# EAGLE design protoboard (EAGLE 6.5.0)
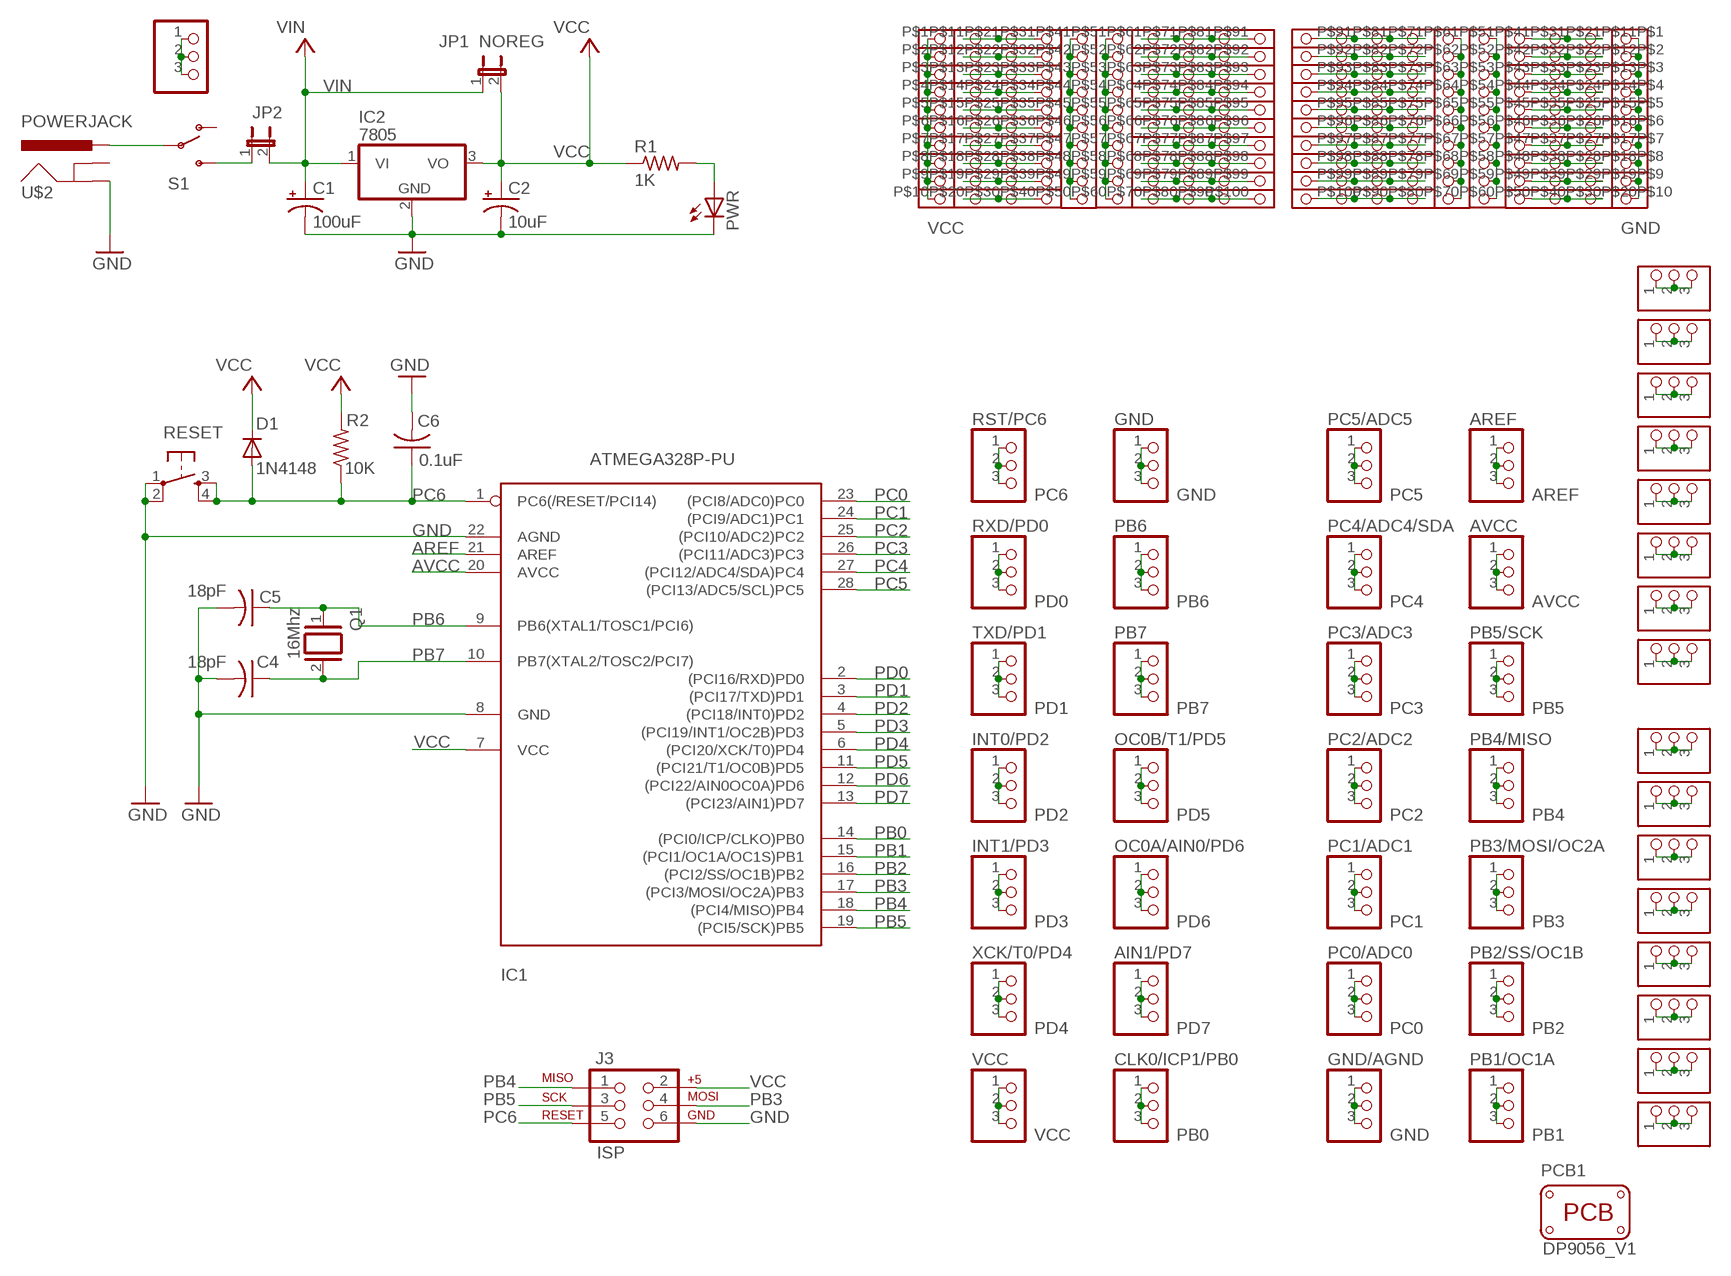
[diagram p0: schematic, sheet 1]

## Parts
AIN1/PD7  PINHD-1X3  [1X03]
AREF  PINHD-1X3  [1X03]
AVCC  PINHD-1X3  [1X03]
C1  100uF  CAP_POLPTH1  [CPOL-RADIAL-100UF-25V]
C2  10uF  CAP_POLPTH2  [CPOL-RADIAL-10UF-25V]
C4  18pF  C-US025-025X050  [C025-025X050]
C5  18pF  C-US025-025X050  [C025-025X050]
C6  0.1uF  C-US025-025X050  [C025-025X050]
CLK0/ICP1/PB0  PINHD-1X3  [1X03]
D1  1N4148  DIODE1N4148  [DIODE-1N4148]
GND  PINHD-1X3  [1X03]
GND/AGND  PINHD-1X3  [1X03]
IC1  ATMEGA328P-PU  ATMEGA168-20P  [DIL28-3]
IC2  7805  7805T  [TO220H]
INT0/PD2  PINHD-1X3  [1X03]
INT1/PD3  PINHD-1X3  [1X03]
J3  ISP  AVR_SPI_PRG_6PTH  [2X3]
JP1  NOREG  JUMPER-2PTH  [1X02]
JP2  TP1  JUMPER-2PTH  [1X02]
OC0A/AIN0/PD6  PINHD-1X3  [1X03]
OC0B/T1/PD5  PINHD-1X3  [1X03]
PB1/OC1A  PINHD-1X3  [1X03]
PB2/SS/OC1B  PINHD-1X3  [1X03]
PB3/MOSI/OC2A  PINHD-1X3  [1X03]
PB4/MISO  PINHD-1X3  [1X03]
PB5/SCK  PINHD-1X3  [1X03]
PB6  PINHD-1X3  [1X03]
PB7  PINHD-1X3  [1X03]
PC0/ADC0  PINHD-1X3  [1X03]
PC1/ADC1  PINHD-1X3  [1X03]
PC2/ADC2  PINHD-1X3  [1X03]
PC3/ADC3  PINHD-1X3  [1X03]
PC4/ADC4/SDA  PINHD-1X3  [1X03]
PC5/ADC5  PINHD-1X3  [1X03]
PCB1  PCB_DP_RECTANGLE-56X90  [DP9056_V1]
PWR  LED3MM  [LED3MM]
Q1  16Mhz  XTAL/S  [QS]
R1  1K  RESISTOR-1/4W  [0207/7]
R2  10K  RESISTOR-1/4W  [0207/7]
RESET  TAC_SWITCHPTH  [TACTILE-PTH]
RST/PC6  PINHD-1X3  [1X03]
RXD/PD0  PINHD-1X3  [1X03]
S1  SWITCH-SPDTPTH  [SWITCH-SPDT]
TXD/PD1  PINHD-1X3  [1X03]
U$1  PROTOFIELD-10X10  [PROTOFIELD-10X10]
U$2  POWERJACK  [POWERJACK_SLOT]
U$3  PROTOFIELD-10X10  [PROTOFIELD-10X10]
U$4  PROTOFIELD-3  [PROTOFIELD-3]
U$5  PROTOFIELD-3  [PROTOFIELD-3]
U$6  PROTOFIELD-3  [PROTOFIELD-3]
U$7  PROTOFIELD-3  [PROTOFIELD-3]
U$8  PROTOFIELD-3  [PROTOFIELD-3]
U$9  PROTOFIELD-3  [PROTOFIELD-3]
U$10  PROTOFIELD-3  [PROTOFIELD-3]
U$11  PROTOFIELD-3  [PROTOFIELD-3]
U$12  PROTOFIELD-3  [PROTOFIELD-3]
U$13  PROTOFIELD-3  [PROTOFIELD-3]
U$14  PROTOFIELD-3  [PROTOFIELD-3]
U$15  PROTOFIELD-3  [PROTOFIELD-3]
U$16  PROTOFIELD-3  [PROTOFIELD-3]
U$17  PROTOFIELD-3  [PROTOFIELD-3]
U$18  PROTOFIELD-3  [PROTOFIELD-3]
U$19  PROTOFIELD-3  [PROTOFIELD-3]
VCC  PINHD-1X3  [1X03]
VIN_  PINHD-1X3  [1X03]
XCK/T0/PD4  PINHD-1X3  [1X03]

## Nets
AREF: AREF.1 AREF.2 AREF.3 IC1.21(AREF)
AVCC: AVCC.1 AVCC.2 AVCC.3 IC1.20(AVCC)
GND: C1.2(-) C2.2(-) C4.2 C5.2 C6.2 GND.1 GND.2 GND.3 GND/AGND.1 GND/AGND.2 GND/AGND.3 IC1.8(GND) IC1.22(AGND) IC2.2(GND) J3.6 PWR.K(C) RESET.1 RESET.2 U$2.GND@1(GND) U$3.P$1 U$3.P$2 U$3.P$3 U$3.P$4 U$3.P$5 U$3.P$6 U$3.P$7 U$3.P$8 U$3.P$9 U$3.P$10
N$1 [supply]: S1.2(P) U$2.PWR
N$2: PWR.A R1.2
N$3 [supply]: JP2.1 S1.3(S)
N$4: U$4.1 U$4.2 U$4.3
N$5: U$5.1 U$5.2 U$5.3
N$6: U$6.1 U$6.2 U$6.3
N$7: U$7.1 U$7.2 U$7.3
N$8: U$8.1 U$8.2 U$8.3
N$9: U$9.1 U$9.2 U$9.3
N$10: U$10.1 U$10.2 U$10.3
N$11: U$11.1 U$11.2 U$11.3
N$12: U$12.1 U$12.2 U$12.3
N$13: U$13.1 U$13.2 U$13.3
N$14: U$14.1 U$14.2 U$14.3
N$15: U$15.1 U$15.2 U$15.3
N$16: U$16.1 U$16.2 U$16.3
N$17: U$17.1 U$17.2 U$17.3
N$18: U$18.1 U$18.2 U$18.3
N$19: U$19.1 U$19.2 U$19.3
N$20: U$1.P$41 U$1.P$42 U$1.P$43 U$1.P$44 U$1.P$45 U$1.P$46 U$1.P$47 U$1.P$48 U$1.P$49 U$1.P$50
N$21: U$1.P$51 U$1.P$52 U$1.P$53 U$1.P$54 U$1.P$55 U$1.P$56 U$1.P$57 U$1.P$58 U$1.P$59 U$1.P$60
N$22: U$1.P$61 U$1.P$71 U$1.P$81 U$1.P$91
N$23: U$1.P$62 U$1.P$72 U$1.P$82 U$1.P$92
N$24: U$1.P$63 U$1.P$73 U$1.P$83 U$1.P$93
N$25: U$1.P$64 U$1.P$74 U$1.P$84 U$1.P$94
N$26: U$1.P$65 U$1.P$75 U$1.P$85 U$1.P$95
N$27: U$1.P$66 U$1.P$76 U$1.P$86 U$1.P$96
N$28: U$1.P$67 U$1.P$77 U$1.P$87 U$1.P$97
N$29: U$1.P$68 U$1.P$78 U$1.P$88 U$1.P$98
N$30: U$1.P$69 U$1.P$79 U$1.P$89 U$1.P$99
N$31: U$1.P$70 U$1.P$80 U$1.P$90 U$1.P$100
N$32: U$1.P$11 U$1.P$21 U$1.P$31
N$33: U$1.P$12 U$1.P$22 U$1.P$32
N$34: U$1.P$13 U$1.P$23 U$1.P$33
N$35: U$1.P$14 U$1.P$24 U$1.P$34
N$36: U$1.P$15 U$1.P$25 U$1.P$35
N$37: U$1.P$16 U$1.P$26 U$1.P$36
N$38: U$1.P$17 U$1.P$27 U$1.P$37
N$39: U$1.P$18 U$1.P$28 U$1.P$38
N$40: U$1.P$19 U$1.P$29 U$1.P$39
N$41: U$1.P$20 U$1.P$30 U$1.P$40
N$42: U$3.P$61 U$3.P$71 U$3.P$81 U$3.P$91
N$43: U$3.P$62 U$3.P$72 U$3.P$82 U$3.P$92
N$44: U$3.P$63 U$3.P$73 U$3.P$83 U$3.P$93
N$45: U$3.P$64 U$3.P$74 U$3.P$84 U$3.P$94
N$46: U$3.P$65 U$3.P$75 U$3.P$85 U$3.P$95
N$47: U$3.P$66 U$3.P$76 U$3.P$86 U$3.P$96
N$48: U$3.P$67 U$3.P$77 U$3.P$87 U$3.P$97
N$49: U$3.P$68 U$3.P$78 U$3.P$88 U$3.P$98
N$50: U$3.P$69 U$3.P$79 U$3.P$89 U$3.P$99
N$51: U$3.P$70 U$3.P$80 U$3.P$90 U$3.P$100
N$52: U$3.P$51 U$3.P$52 U$3.P$53 U$3.P$54 U$3.P$55 U$3.P$56 U$3.P$57 U$3.P$58 U$3.P$59 U$3.P$60
N$53: U$3.P$41 U$3.P$42 U$3.P$43 U$3.P$44 U$3.P$45 U$3.P$46 U$3.P$47 U$3.P$48 U$3.P$49 U$3.P$50
N$54: U$3.P$11 U$3.P$21 U$3.P$31
N$55: U$3.P$12 U$3.P$22 U$3.P$32
N$56: U$3.P$13 U$3.P$23 U$3.P$33
N$57: U$3.P$14 U$3.P$24 U$3.P$34
N$58: U$3.P$15 U$3.P$25 U$3.P$35
N$59: U$3.P$16 U$3.P$26 U$3.P$36
N$60: U$3.P$17 U$3.P$27 U$3.P$37
N$61: U$3.P$18 U$3.P$28 U$3.P$38
N$62: U$3.P$19 U$3.P$29 U$3.P$39
N$63: U$3.P$20 U$3.P$30 U$3.P$40
PB0: CLK0/ICP1/PB0.1 CLK0/ICP1/PB0.2 CLK0/ICP1/PB0.3 IC1.14((PCI0/ICP/CLKO)PB0)
PB1: IC1.15((PCI1/OC1A/OC1S)PB1) PB1/OC1A.1 PB1/OC1A.2 PB1/OC1A.3
PB2: IC1.16((PCI2/SS/OC1B)PB2) PB2/SS/OC1B.1 PB2/SS/OC1B.2 PB2/SS/OC1B.3
PB3: IC1.17((PCI3/MOSI/OC2A)PB3) J3.4 PB3/MOSI/OC2A.1 PB3/MOSI/OC2A.2 PB3/MOSI/OC2A.3
PB4: IC1.18((PCI4/MISO)PB4) J3.1 PB4/MISO.1 PB4/MISO.2 PB4/MISO.3
PB5: IC1.19((PCI5/SCK)PB5) J3.3 PB5/SCK.1 PB5/SCK.2 PB5/SCK.3
PB6: C5.1 IC1.9(PB6(XTAL1/TOSC1/PCI6)) PB6.1 PB6.2 PB6.3 Q1.1
PB7: C4.1 IC1.10(PB7(XTAL2/TOSC2/PCI7)) PB7.1 PB7.2 PB7.3 Q1.2
PC0: IC1.23((PCI8/ADC0)PC0) PC0/ADC0.1 PC0/ADC0.2 PC0/ADC0.3
PC1: IC1.24((PCI9/ADC1)PC1) PC1/ADC1.1 PC1/ADC1.2 PC1/ADC1.3
PC2: IC1.25((PCI10/ADC2)PC2) PC2/ADC2.1 PC2/ADC2.2 PC2/ADC2.3
PC3: IC1.26((PCI11/ADC3)PC3) PC3/ADC3.1 PC3/ADC3.2 PC3/ADC3.3
PC4: IC1.27((PCI12/ADC4/SDA)PC4) PC4/ADC4/SDA.1 PC4/ADC4/SDA.2 PC4/ADC4/SDA.3
PC5: IC1.28((PCI13/ADC5/SCL)PC5) PC5/ADC5.1 PC5/ADC5.2 PC5/ADC5.3
PC6: C6.1 D1.A IC1.1(PC6(/RESET/PCI14)) J3.5 R2.1 RESET.3 RESET.4 RST/PC6.1 RST/PC6.2 RST/PC6.3
PD0: IC1.2((PCI16/RXD)PD0) RXD/PD0.1 RXD/PD0.2 RXD/PD0.3
PD1: IC1.3((PCI17/TXD)PD1) TXD/PD1.1 TXD/PD1.2 TXD/PD1.3
PD2: IC1.4((PCI18/INT0)PD2) INT0/PD2.1 INT0/PD2.2 INT0/PD2.3
PD3: IC1.5((PCI19/INT1/OC2B)PD3) INT1/PD3.1 INT1/PD3.2 INT1/PD3.3
PD4: IC1.6((PCI20/XCK/T0)PD4) XCK/T0/PD4.1 XCK/T0/PD4.2 XCK/T0/PD4.3
PD5: IC1.11((PCI21/T1/OC0B)PD5) OC0B/T1/PD5.1 OC0B/T1/PD5.2 OC0B/T1/PD5.3
PD6: IC1.12((PCI22/AIN0OC0A)PD6) OC0A/AIN0/PD6.1 OC0A/AIN0/PD6.2 OC0A/AIN0/PD6.3
PD7: AIN1/PD7.1 AIN1/PD7.2 AIN1/PD7.3 IC1.13((PCI23/AIN1)PD7)
VCC: C2.1(+) D1.C IC1.7(VCC) IC2.3(VO) J3.2 JP1.2 R1.1 R2.2 U$1.P$1 U$1.P$2 U$1.P$3 U$1.P$4 U$1.P$5 U$1.P$6 U$1.P$7 U$1.P$8 U$1.P$9 U$1.P$10 VCC.1 VCC.2 VCC.3
VIN [supply]: C1.1(+) IC2.1(VI) JP1.1 JP2.2 VIN_.1 VIN_.2 VIN_.3
Unconnected: S1.1(O) U$2.GND@2(GNDBREAK)

## Library data of the parts
AIN1/PD7 AREF AVCC CLK0/ICP1/PB0 GND GND/AGND INT0/PD2 INT1/PD3 OC0A/AIN0/PD6 OC0B/T1/PD5 PB1/OC1A PB2/SS/OC1B PB3/MOSI/OC2A PB4/MISO PB5/SCK PB6 PB7 PC0/ADC0 PC1/ADC1 PC2/ADC2 PC3/ADC3 PC4/ADC4/SDA PC5/ADC5 RST/PC6 RXD/PD0 TXD/PD1 VCC VIN_ XCK/T0/PD4 = ubiyubix:PINHD-1X3
C1 C2 = SparkFun-Passives:CAP_POL: Capacitor Polarized These are standard SMD and PTH capacitors. Normally 10uF, 47uF, and 100uF in electrolytic and tantalum varieties. Always verify the external diameter of the through hole cap, it varies with capacity, voltage, and manufacturer. The EIA devices should be standard.
C4-C6 = rcl:C-US: CAPACITOR, American symbol
D1 = SparkFun-DiscreteSemi:DIODE: Diode These are standard reverse protection diodes and small signal diodes. SMA package can handle up to about 1A. SOD-323 can handle about 200mA. What the SOD-323 package when ordering, there are some mfgs out there that are 5-pin packages.
IC1 = adafruit:ATMEGA168*P: MICROCONTROLLER 16 kBytes FLASH 1 kBytes SRAM 512 Bytes EEPROM USART 8-channel 10 bit ADC
IC2 = linear:78*: Positive VOLTAGE REGULATOR Source: http://cache.national.com/ds/LM/LM78L05.pdf http://www.fairchildsemi.com/ds/LM/LM7805.pdf
J3 = SparkFun-Connectors:AVR_SPI_PRG_6: AVR ISP 6 Pin This is the reduced ISP connector for AVR programming. Common on Arduino. This footprint will take up less PCB space and can be used with a 10-pin to 6-pin adapter such as SKU: BOB-08508
JP1 JP2 = SparkFun-Passives:JUMPER-2: Jumper Basic 0.1" spaced jumper. Use with breakaway headers.
PCB1 = dp_devices:PCB_DP_RECTANGLE: Dangerous Prototypes Standard Rectangular PCB sizes; PCB_SIZE: DP9056_V1
PWR = SparkFun-LED:LED: LEDs Standard schematic elements and footprints for 5mm, 3mm, 1206, and 0603 sized LEDs. 5mm - Spark Fun Electronics SKU : COM-00529 (and others)
Q1 = SmartPrj:XTAL/S: CRYSTAL
R1 R2 = ubiyubix:RESISTOR-1/4W
RESET = SparkFun-Electromechanical:TAC_SWITCH: Momentary Switch Button commonly used for reset or general input. Spark Fun Electronics SKU : COM-00097
S1 = ubiyubix:SWITCH-SPDT: SPST Switch Simple slide switch. Spark Fun Electronics SKU : COM-00102
U$1 U$3 = ubiyubix:PROTOFIELD-10X10
U$2 = ubiyubix:POWERJACK
U$4-U$19 = ubiyubix:PROTOFIELD-3

## Net classes
0 default: width 0.406 mm
1 supply: width 0.508 mm

## Board
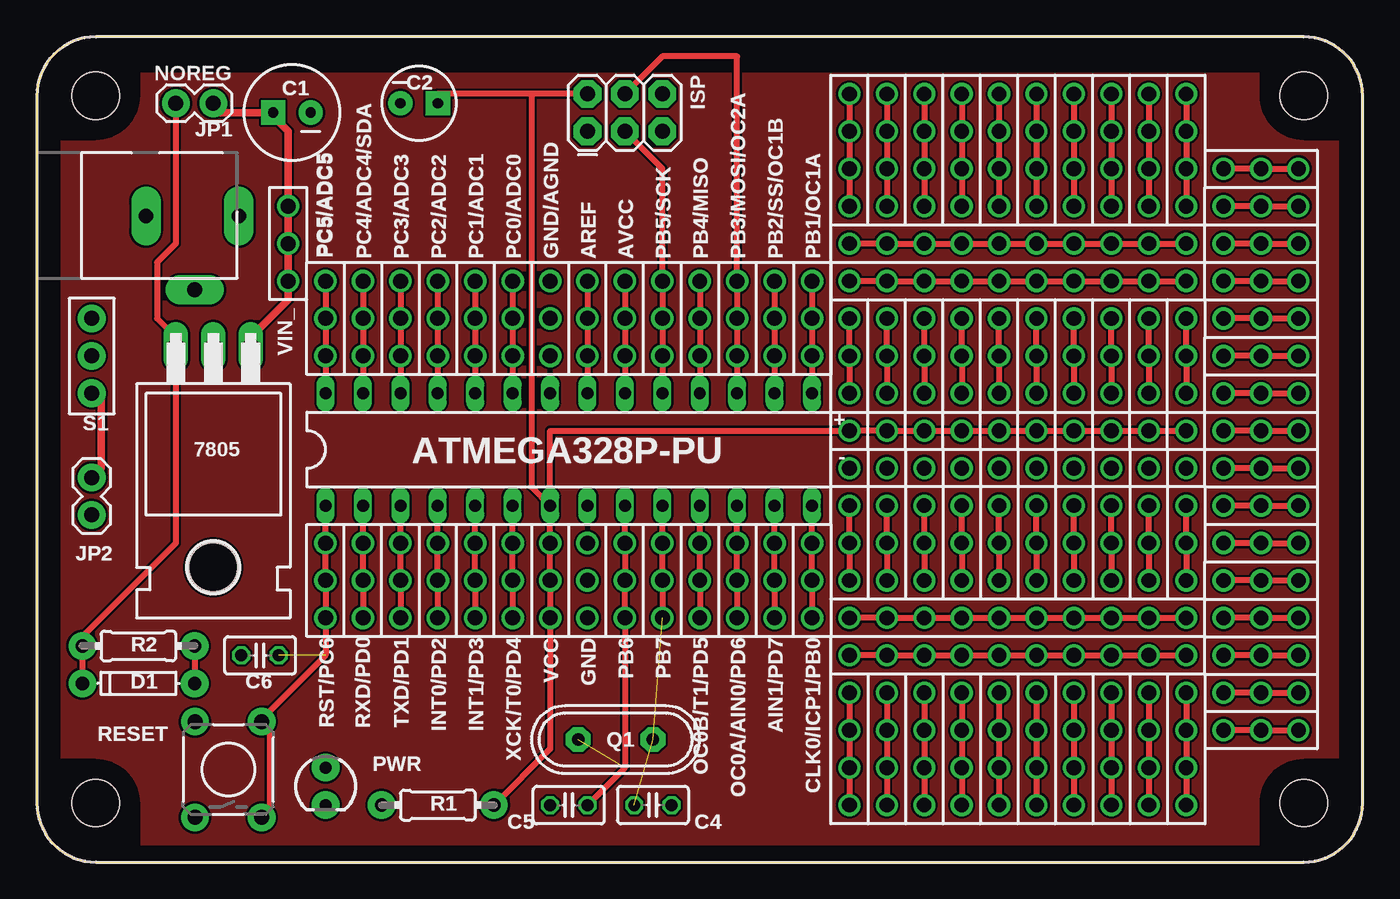
[diagram p1: board, top side]
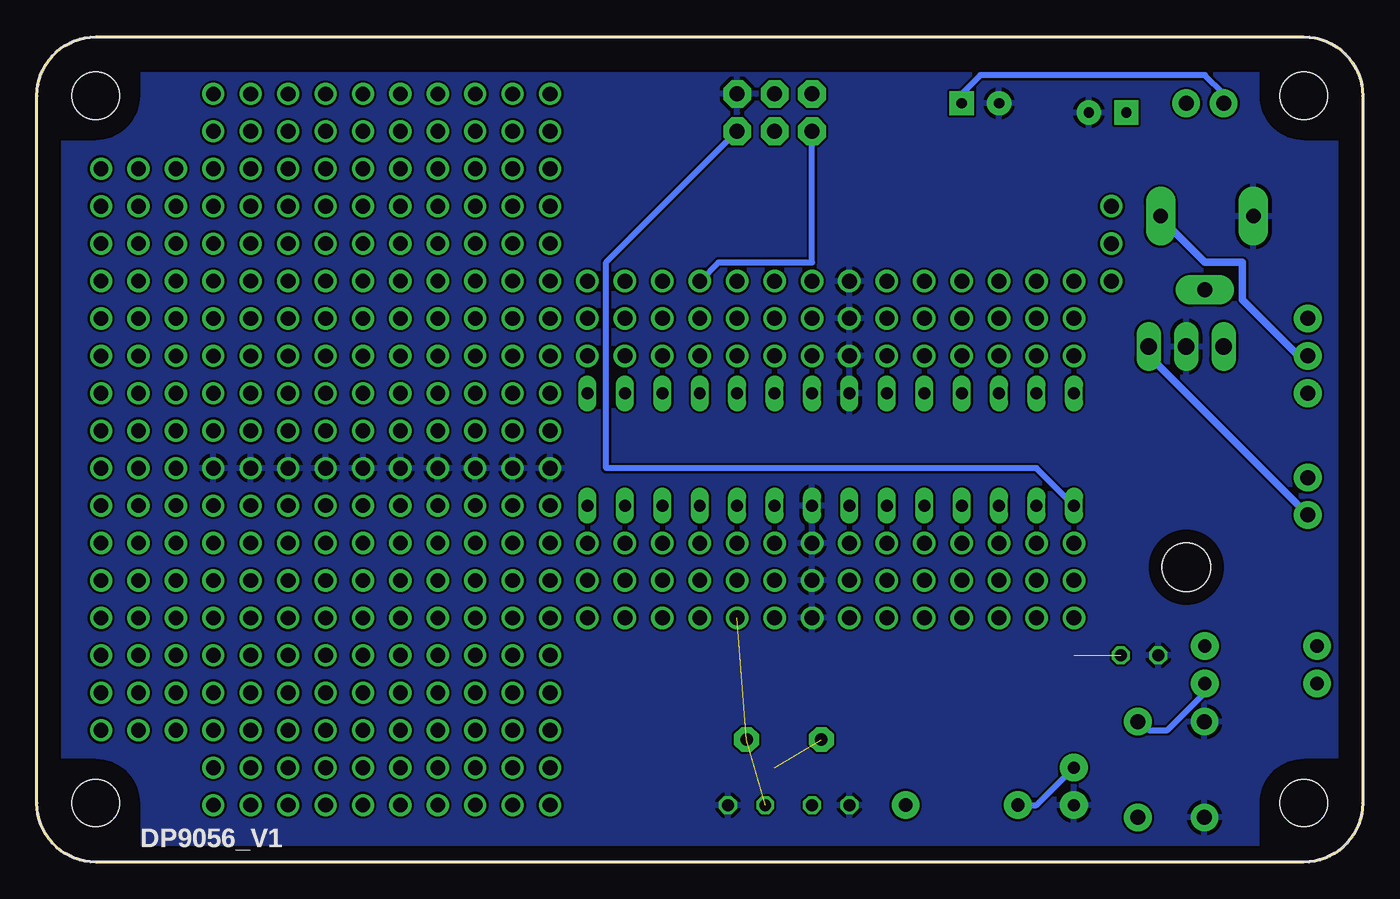
[diagram p2: board, bottom side, seen from below]

Size 90 x 56 mm. Coordinates in mm from the lower left corner, seen from the top.
Copper layers (1*16): Top 0.0356mm / dielectric 1.5011mm / Bottom 0.0356mm
Design rules "LaenPCBOrder (1)": minimum track width 6mil, minimum drill 13mil, track to track 6mil, track to pad 6mil, pad to pad 6mil, via to via 6mil, smd to smd 6mil, copper to edge 15mil, drill to drill 6mil, minimum pad ring 7mil, minimum via ring 7mil, stop-mask expansion 3mil, vias tented up to drill 0mil, thermal gap 10mil

### Footprints (pad centres in the part's own frame; a part is rotated, then mirrored left to right if it is on the bottom)
1X03 = drill 1.016: 1 -2.54,0; 2 0,0; 3 2.54,0
CPOL-RADIAL-100UF-25V = drill 0.7 pad 1.651 square: 1 1.27,0 | drill 0.7 pad 1.651: 2 -1.27,0
CPOL-RADIAL-10UF-25V = drill 0.7 pad 1.651 square: 1 1.27,0 | drill 0.7 pad 1.651: 2 -1.27,0
C025-025X050 = drill 0.813 octagon: 1 -1.27,0; 2 1.27,0
DIODE-1N4148 = drill 0.9 pad 1.88: A -3.81,0; C 3.81,0
DIL28-3 = drill 0.813 long: 1 -16.51,-3.81; 2 -13.97,-3.81; 3 -11.43,-3.81; 4 -8.89,-3.81; 5 -6.35,-3.81; 6 -3.81,-3.81; 7 -1.27,-3.81; 8 1.27,-3.81; 9 3.81,-3.81; 10 6.35,-3.81; 11 8.89,-3.81; 12 11.43,-3.81; 13 13.97,-3.81; 14 16.51,-3.81; 15 16.51,3.81; 16 13.97,3.81; 17 11.43,3.81; 18 8.89,3.81; 19 6.35,3.81; 20 3.81,3.81; 21 1.27,3.81; 22 -1.27,3.81; 23 -3.81,3.81; 24 -6.35,3.81; 25 -8.89,3.81; 26 -11.43,3.81; 27 -13.97,3.81; 28 -16.51,3.81
TO220H = drill 1.118 long: 1 -2.54,-10.16; 2 0,-10.16; 3 2.54,-10.16 | hole 3.302: 0,4.826
2X3 = drill 1.016 pad 1.88 octagon: 1 0,0; 2 0,2.54; 3 2.54,0; 4 2.54,2.54; 5 5.08,0; 6 5.08,2.54
1X02 = drill 1.016 pad 1.88: 1 0,0; 2 2.54,0
DP9056_V1 = hole 3.2: -41,-24; 41,-24; 41,24; -41,24
LED3MM = drill 0.813 pad 1.88: A -1.27,0; K 1.27,0
QS = drill 0.85 pad 1.676 octagon: 1 -2.54,0; 2 2.54,0
0207/7 = drill 0.9 pad 1.88: 1 -3.81,0; 2 3.81,0
TACTILE-PTH = drill 1.016 pad 1.88: 1 -3.251,2.261; 2 3.251,2.261; 3 -3.251,-2.261; 4 3.251,-2.261
SWITCH-SPDT = drill 1.016 pad 1.88: 1 0,2.54; 2 0,0; 3 0,-2.54
PROTOFIELD-10X10 = drill 1: P$1 -11.43,11.43; P$2 -11.43,8.89; P$3 -11.43,6.35; P$4 -11.43,3.81; P$5 -11.43,1.27; P$6 -11.43,-1.27; P$7 -11.43,-3.81; P$8 -11.43,-6.35; P$9 -11.43,-8.89; P$10 -11.43,-11.43; P$11 -8.89,11.43; P$12 -8.89,8.89; P$13 -8.89,6.35; P$14 -8.89,3.81; P$15 -8.89,1.27; P$16 -8.89,-1.27; P$17 -8.89,-3.81; P$18 -8.89,-6.35; P$19 -8.89,-8.89; P$20 -8.89,-11.43; P$21 -6.35,11.43; P$22 -6.35,8.89; P$23 -6.35,6.35; P$24 -6.35,3.81; P$25 -6.35,1.27; P$26 -6.35,-1.27; P$27 -6.35,-3.81; P$28 -6.35,-6.35; P$29 -6.35,-8.89; P$30 -6.35,-11.43; P$31 -3.81,11.43; P$32 -3.81,8.89; P$33 -3.81,6.35; P$34 -3.81,3.81; P$35 -3.81,1.27; P$36 -3.81,-1.27; P$37 -3.81,-3.81; P$38 -3.81,-6.35; P$39 -3.81,-8.89; P$40 -3.81,-11.43; P$41 -1.27,11.43; P$42 -1.27,8.89; P$43 -1.27,6.35; P$44 -1.27,3.81; P$45 -1.27,1.27; P$46 -1.27,-1.27; P$47 -1.27,-3.81; P$48 -1.27,-6.35; P$49 -1.27,-8.89; P$50 -1.27,-11.43; P$51 1.27,11.43; P$52 1.27,8.89; P$53 1.27,6.35; P$54 1.27,3.81; P$55 1.27,1.27; P$56 1.27,-1.27; P$57 1.27,-3.81; P$58 1.27,-6.35; P$59 1.27,-8.89; P$60 1.27,-11.43; P$61 3.81,11.43; P$62 3.81,8.89; P$63 3.81,6.35; P$64 3.81,3.81; P$65 3.81,1.27; P$66 3.81,-1.27; P$67 3.81,-3.81; P$68 3.81,-6.35; P$69 3.81,-8.89; P$70 3.81,-11.43; P$71 6.35,11.43; P$72 6.35,8.89; P$73 6.35,6.35; P$74 6.35,3.81; P$75 6.35,1.27; P$76 6.35,-1.27; P$77 6.35,-3.81; P$78 6.35,-6.35; P$79 6.35,-8.89; P$80 6.35,-11.43; P$81 8.89,11.43; P$82 8.89,8.89; P$83 8.89,6.35; P$84 8.89,3.81; P$85 8.89,1.27; P$86 8.89,-1.27; P$87 8.89,-3.81; P$88 8.89,-6.35; P$89 8.89,-8.89; P$90 8.89,-11.43; P$91 11.43,11.43; P$92 11.43,8.89; P$93 11.43,6.35; P$94 11.43,3.81; P$95 11.43,1.27; P$96 11.43,-1.27; P$97 11.43,-3.81; P$98 11.43,-6.35; P$99 11.43,-8.89; P$100 11.43,-11.43
POWERJACK_SLOT = drill 1 pad 2 long: GND@1 0.04,-0.12; GND@2 5.04,3.18; PWR 0.04,6.18
PROTOFIELD-3 = drill 1: 1 0,2.54; 2 0,0; 3 0,-2.54

### Placement (x,y rotation side)
AIN1/PD7  50.08,19.11 90 top
AREF  37.38,36.89 90 top
AVCC  39.92,36.89 90 top
C1  17.31,50.86 180 top
C2  25.95,51.5 0 top
C4  41.83,3.87 0 top
C5  36.11,3.87 180 top
C6  15.16,14.03 180 top
CLK0/ICP1/PB0  52.62,19.11 90 top
D1  6.9,12.12 180 top
GND  37.38,19.11 90 top
GND/AGND  34.84,36.89 90 top
IC1  36.11,28 0 top
IC2  11.98,24.82 180 top
INT0/PD2  27.22,19.11 90 top
INT1/PD3  29.76,19.11 90 top
J3  37.38,49.59 0 top
JP1  11.98,51.5 180 top
JP2  3.73,26.09 270 top
OC0A/AIN0/PD6  47.54,19.11 90 top
OC0B/T1/PD5  45,19.11 90 top
PB1/OC1A  52.62,36.89 90 top
PB2/SS/OC1B  50.08,36.89 90 top
PB3/MOSI/OC2A  47.54,36.89 90 top
PB4/MISO  45,36.89 90 top
PB5/SCK  42.46,36.89 90 top
PB6  39.92,19.11 90 top
PB7  42.46,19.11 90 top
PC0/ADC0  32.3,36.89 90 top
PC1/ADC1  29.76,36.89 90 top
PC2/ADC2  27.22,36.89 90 top
PC3/ADC3  24.68,36.89 90 top
PC4/ADC4/SDA  22.14,36.89 90 top
PC5/ADC5  19.6,36.89 90 top
PCB1  45,28 0 top
PWR  19.6,5.14 270 top
Q1  39.29,8.31 0 top
R1  27.22,3.87 180 top
R2  6.9,14.66 180 top
RESET  13,6.28 90 top
RST/PC6  19.6,19.11 90 top
RXD/PD0  22.14,19.11 90 top
S1  3.73,34.35 0 top
TXD/PD1  24.68,19.11 90 top
U$1  66.59,40.7 90 top
U$2  7.54,43.88 270 top
U$3  66.59,15.3 270 top
U$4  83.1,47.05 90 top
U$5  83.1,44.51 90 top
U$6  83.1,41.97 90 top
U$7  83.1,39.43 90 top
U$8  83.1,36.89 90 top
U$9  83.1,34.35 90 top
U$10  83.1,31.81 90 top
U$11  83.1,29.27 90 top
U$12  83.1,26.73 90 top
U$13  83.1,24.19 90 top
U$14  83.1,21.65 90 top
U$15  83.1,19.11 90 top
U$16  83.1,16.57 90 top
U$17  83.1,14.03 90 top
U$18  83.1,11.49 90 top
U$19  83.1,8.95 90 top
VCC  34.84,19.11 90 top
VIN_  17.06,41.97 90 top
XCK/T0/PD4  32.3,19.11 90 top

### Tracks (layer width: path | path; a pad name or v marks a point on that pad's centre or on a via)
AREF
  Top 0.406: IC1.21 AREF.1 AREF.2 AREF.3
AVCC
  Top 0.406: IC1.20 AVCC.1 AVCC.2 AVCC.3
GND
  pour Bottom: 6.9,53.4 85.64,53.4 arc-90 88.18,50.86 88.18,2.6 arc-90 86.91,1.33 3.09,1.33 arc-90 1.82,2.6 1.82,52.13 arc-90 3.09,53.4
N$1
  Bottom 0.508: S1.2 4.36,34.35 8.17,38.16 8.17,40.7 10.71,40.7 13.25,43.24 U$2.PWR
N$2
  Bottom 0.406: PWR.A 22.14,3.87 R1.2
N$3
  Top 0.508: JP2.1 4.36,26.73 4.36,31.81 S1.3
N$4
  Top 0.406: U$4.1 U$4.2 U$4.3
N$5
  Top 0.406: U$5.1 U$5.2 U$5.3
N$6
  Top 0.406: U$6.1 U$6.2 U$6.3
N$7
  Top 0.406: U$7.1 U$7.2 U$7.3
N$8
  Top 0.406: U$8.1 U$8.2 U$8.3
N$9
  Top 0.406: U$9.1 U$9.2 U$9.3
N$10
  Top 0.406: U$10.1 U$10.2 U$10.3
N$11
  Top 0.406: U$11.1 U$11.2 U$11.3
N$12
  Top 0.406: U$12.1 U$12.2 U$12.3
N$13
  Top 0.406: U$13.1 U$13.2 U$13.3
N$14
  Top 0.406: U$14.1 U$14.2 U$14.3
N$15
  Top 0.406: U$15.1 U$15.2 U$15.3
N$16
  Top 0.406: U$16.1 U$16.2 U$16.3
N$17
  Top 0.406: U$17.1 U$17.2 U$17.3
N$18
  Top 0.406: U$18.1 U$18.2 U$18.3
N$19
  Top 0.406: U$19.1 U$19.2 U$19.3
N$20
  Top 0.406: U$1.P$41 U$1.P$42 U$1.P$43 U$1.P$44 U$1.P$45 U$1.P$46 U$1.P$47 U$1.P$48 U$1.P$49 U$1.P$50
N$21
  Top 0.406: U$1.P$51 U$1.P$52 U$1.P$53 U$1.P$54 U$1.P$55 U$1.P$56 U$1.P$57 U$1.P$58 U$1.P$59 U$1.P$60
N$22
  Top 0.406: U$1.P$61 U$1.P$71 U$1.P$81 U$1.P$91
N$23
  Top 0.406: U$1.P$62 U$1.P$72 U$1.P$82 U$1.P$92
N$24
  Top 0.406: U$1.P$63 U$1.P$73 U$1.P$83 U$1.P$93
N$25
  Top 0.406: U$1.P$64 U$1.P$74 U$1.P$84 U$1.P$94
N$26
  Top 0.406: U$1.P$65 U$1.P$75 U$1.P$85 U$1.P$95
N$27
  Top 0.406: U$1.P$66 U$1.P$76 U$1.P$86 U$1.P$96
N$28
  Top 0.406: U$1.P$67 U$1.P$77 U$1.P$87 U$1.P$97
N$29
  Top 0.406: U$1.P$68 U$1.P$78 U$1.P$88 U$1.P$98
N$30
  Top 0.406: U$1.P$69 U$1.P$79 U$1.P$89 U$1.P$99
N$31
  Top 0.406: U$1.P$70 U$1.P$80 U$1.P$90 U$1.P$100
N$32
  Top 0.406: U$1.P$11 U$1.P$21 U$1.P$31
N$33
  Top 0.406: U$1.P$12 U$1.P$22 U$1.P$32
N$34
  Top 0.406: U$1.P$13 U$1.P$23 U$1.P$33
N$35
  Top 0.406: U$1.P$14 U$1.P$24 U$1.P$34
N$36
  Top 0.406: U$1.P$15 U$1.P$25 U$1.P$35
N$37
  Top 0.406: U$1.P$16 U$1.P$26 U$1.P$36
N$38
  Top 0.406: U$1.P$17 U$1.P$27 U$1.P$37
N$39
  Top 0.406: U$1.P$18 U$1.P$28 U$1.P$38
N$40
  Top 0.406: U$1.P$19 U$1.P$29 U$1.P$39
N$41
  Top 0.406: U$1.P$20 U$1.P$30 U$1.P$40
N$42
  Top 0.406: U$3.P$91 U$3.P$81 U$3.P$71 U$3.P$61
N$43
  Top 0.406: U$3.P$92 U$3.P$82 U$3.P$72 U$3.P$62
N$44
  Top 0.406: U$3.P$93 U$3.P$83 U$3.P$73 U$3.P$63
N$45
  Top 0.406: U$3.P$94 U$3.P$84 U$3.P$74 U$3.P$64
N$46
  Top 0.406: U$3.P$95 U$3.P$85 U$3.P$75 U$3.P$65
N$47
  Top 0.406: U$3.P$96 U$3.P$86 U$3.P$76 U$3.P$66
N$48
  Top 0.406: U$3.P$97 U$3.P$87 U$3.P$77 U$3.P$67
N$49
  Top 0.406: U$3.P$98 U$3.P$88 U$3.P$78 U$3.P$68
N$50
  Top 0.406: U$3.P$99 U$3.P$89 U$3.P$79 U$3.P$69
N$51
  Top 0.406: U$3.P$100 U$3.P$90 U$3.P$80 U$3.P$70
N$52
  Top 0.406: U$3.P$60 U$3.P$59 U$3.P$58 U$3.P$57 U$3.P$56 U$3.P$55 U$3.P$54 U$3.P$53 U$3.P$52 U$3.P$51
N$53
  Top 0.406: U$3.P$50 U$3.P$49 U$3.P$48 U$3.P$47 U$3.P$46 U$3.P$45 U$3.P$44 U$3.P$43 U$3.P$42 U$3.P$41
N$54
  Top 0.406: U$3.P$31 U$3.P$21 U$3.P$11
N$55
  Top 0.406: U$3.P$32 U$3.P$22 U$3.P$12
N$56
  Top 0.406: U$3.P$33 U$3.P$23 U$3.P$13
N$57
  Top 0.406: U$3.P$34 U$3.P$24 U$3.P$14
N$58
  Top 0.406: U$3.P$35 U$3.P$25 U$3.P$15
N$59
  Top 0.406: U$3.P$36 U$3.P$26 U$3.P$16
N$60
  Top 0.406: U$3.P$37 U$3.P$27 U$3.P$17
N$61
  Top 0.406: U$3.P$38 U$3.P$28 U$3.P$18
N$62
  Top 0.406: U$3.P$39 U$3.P$29 U$3.P$19
N$63
  Top 0.406: U$3.P$40 U$3.P$30 U$3.P$20
N$64
  pour Top: 3.09,53.4 86.91,53.4 arc-90 88.18,52.13 88.18,2.6 arc-90 86.91,1.33 3.09,1.33 arc-90 1.82,2.6 1.82,52.13 arc90
PB0
  Top 0.406: IC1.14 CLK0/ICP1/PB0.3 CLK0/ICP1/PB0.2 CLK0/ICP1/PB0.1
PB1
  Top 0.406: IC1.15 PB1/OC1A.1 PB1/OC1A.2 PB1/OC1A.3
PB2
  Top 0.406: IC1.16 PB2/SS/OC1B.1 PB2/SS/OC1B.2 PB2/SS/OC1B.3
PB3
  Top 0.406: IC1.17 PB3/MOSI/OC2A.1 PB3/MOSI/OC2A.2 PB3/MOSI/OC2A.3 47.54,54.67 42.46,54.67 J3.4
PB4
  Top 0.406: IC1.18 PB4/MISO.1 PB4/MISO.2 PB4/MISO.3
  Bottom 0.406: J3.1 37.38,40.7 43.73,40.7 PB4/MISO.3
PB5
  Top 0.406: IC1.19 PB5/SCK.1 PB5/SCK.2 PB5/SCK.3 42.46,47.05 J3.3
PB6  (1 unrouted)
  Top 0.406: IC1.9 PB6.3 PB6.2 PB6.1 39.92,6.41 C5.1
PB7  (2 unrouted)
  Top 0.406: IC1.10 PB7.3 PB7.2 PB7.1
PC0
  Top 0.406: IC1.23 PC0/ADC0.1 PC0/ADC0.2 PC0/ADC0.3
PC1
  Top 0.406: IC1.24 PC1/ADC1.1 PC1/ADC1.2 PC1/ADC1.3
PC2
  Top 0.406: IC1.25 PC2/ADC2.1 PC2/ADC2.2 PC2/ADC2.3
PC3
  Top 0.406: IC1.26 PC3/ADC3.1 PC3/ADC3.2 PC3/ADC3.3
PC4
  Top 0.406: IC1.27 PC4/ADC4/SDA.1 PC4/ADC4/SDA.2 PC4/ADC4/SDA.3
PC5
  Top 0.406: IC1.28 PC5/ADC5.1 PC5/ADC5.2 PC5/ADC5.3
PC6  (1 unrouted)
  Top 0.406: R2.1 D1.A | RESET.3 15.79,2.6 15.79,8.95 RESET.4 15.79,10.22 19.6,14.03 RST/PC6.1 RST/PC6.2 RST/PC6.3 IC1.1
  Bottom 0.406: D1.A 10.71,11.49 13.25,8.95 14.52,8.95 RESET.4 | J3.5 51.35,40.7 51.35,26.73 22.14,26.73 IC1.1
PD0
  Top 0.406: IC1.2 RXD/PD0.3 RXD/PD0.2 RXD/PD0.1
PD1
  Top 0.406: IC1.3 TXD/PD1.3 TXD/PD1.2 TXD/PD1.1
PD2
  Top 0.406: IC1.4 INT0/PD2.3 INT0/PD2.2 INT0/PD2.1
PD3
  Top 0.406: IC1.5 INT1/PD3.3 INT1/PD3.2 INT1/PD3.1
PD4
  Top 0.406: IC1.6 XCK/T0/PD4.3 XCK/T0/PD4.2 XCK/T0/PD4.1
PD5
  Top 0.406: IC1.11 OC0B/T1/PD5.3 OC0B/T1/PD5.2 OC0B/T1/PD5.1
PD6
  Top 0.406: IC1.12 OC0A/AIN0/PD6.3 OC0A/AIN0/PD6.2 OC0A/AIN0/PD6.1
PD7
  Top 0.406: IC1.13 AIN1/PD7.3 AIN1/PD7.2 AIN1/PD7.1
VCC
  Top 0.406: U$1.P$10 U$1.P$9 U$1.P$8 U$1.P$7 U$1.P$6 U$1.P$5 U$1.P$4 U$1.P$3 U$1.P$2 U$1.P$1 34.84,29.27 IC1.7 | IC1.7 VCC.3 VCC.2 VCC.1 34.84,7.68 R1.1 | J3.2 33.57,52.13 | 33.57,52.13 27.22,52.13 C2.1 | D1.C R2.2 3.09,15.3 9.44,21.65 IC2.3 9.44,35.62 8.17,36.89 8.17,40.7 9.44,41.97 JP1.2 | IC1.7 33.57,25.46 33.57,52.13
  Bottom 0.406: C2.1 27.22,52.13 25.95,53.4 10.71,53.4 9.44,52.13 JP1.2
VIN
  Top 0.508: 15.79,50.86 11.98,50.86 JP1.1 | IC2.1 14.52,35.62 17.06,38.16 VIN_.1 VIN_.2 VIN_.3 17.06,49.59 15.79,50.86 | 15.79,50.86 C1.1
  Bottom 0.508: JP2.2 14.52,34.35 IC2.1

### Text on the board
_tsilk: NOREG | C1 | ISP | C2 | JP1 | PC5/ADC5 | PC4/ADC4/SDA | PC3/ADC3 | PC2/ADC2 | PC1/ADC1 | PC0/ADC0 | GND/AGND | AREF | AVCC | PB5/SCK | PB4/MISO | PB3/MOSI/OC2A | PB2/SS/OC1B | PB1/OC1A | VIN_ | + | S1 | 7805 | ATMEGA328P-PU | - | JP2 | R2 | RST/PC6 | RXD/PD0 | TXD/PD1 | INT0/PD2 | INT1/PD3 | XCK/T0/PD4 | VCC | GND | PB6 | PB7 | OC0B/T1/PD5 | OC0A/AIN0/PD6 | AIN1/PD7 | CLK0/ICP1/PB0 | D1 | C6 | RESET | Q1 | PWR | R1 | C5 | C4
_bsilk: DP9056_V1